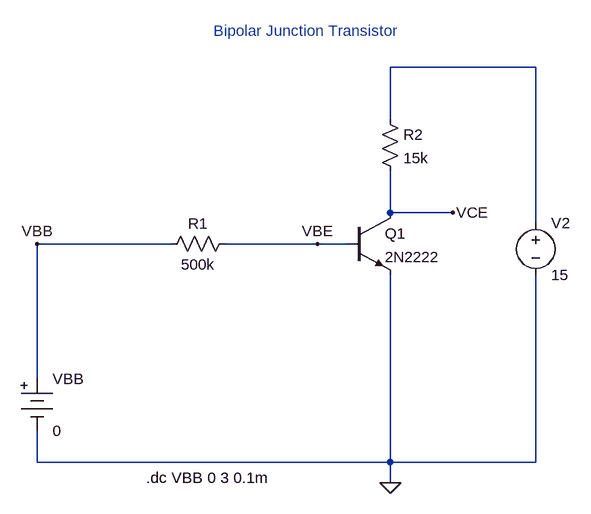
[diagram p0: schematic 2EEB_VELASCO_EXPT6_CKT1.asc]
2EEB_VELASCO_EXPT6_CKT1.asc, the LTspice schematic file:
Version 4
SHEET 1 880 680
WIRE 688 -272 464 -272
WIRE 464 -192 464 -272
WIRE 464 -48 464 -112
WIRE 560 -48 464 -48
WIRE 688 -32 688 -272
WIRE 128 0 -80 0
WIRE 352 0 208 0
WIRE 400 0 352 0
WIRE -80 208 -80 0
WIRE -80 336 -80 288
WIRE 464 336 464 48
WIRE 464 336 -80 336
WIRE 688 336 688 48
WIRE 688 336 464 336
WIRE 464 368 464 336
FLAG 464 368 0
FLAG -80 0 VBB
FLAG 352 0 VBE
FLAG 560 -48 VCE
SYMBOL Misc\\battery -80 192 R0
SYMATTR InstName VBB
SYMATTR Value 0
SYMBOL res 224 -16 R90
WINDOW 0 0 56 VBottom 2
WINDOW 3 32 56 VTop 2
SYMATTR InstName R1
SYMATTR Value 500k
SYMBOL npn 400 -48 R0
SYMATTR InstName Q1
SYMATTR Value 2N2222
SYMBOL res 448 -208 R0
SYMATTR InstName R2
SYMATTR Value 15k
SYMBOL voltage 688 -48 R0
SYMATTR InstName V2
SYMATTR Value 15
TEXT 88 360 Left 2 !.dc VBB 0 3 0.1m
TEXT 192 -328 Left 2 ;Bipolar Junction Transistor

The netlist it stands for:
* 2EEB_VELASCO_EXPT6_CKT1.asc
VBB VBB 0 0
R1 VBE VBB 500k
Q1 VCE VBE 0 0 2N2222
R2 N001 VCE 15k
V2 N001 0 15
.model NPN NPN
.model PNP PNP
.lib standard.bjt
.dc VBB 0 3 0.1m
* Bipolar Junction Transistor
.backanno
.end